# EAGLE design automation_node (EAGLE 9.4.2)
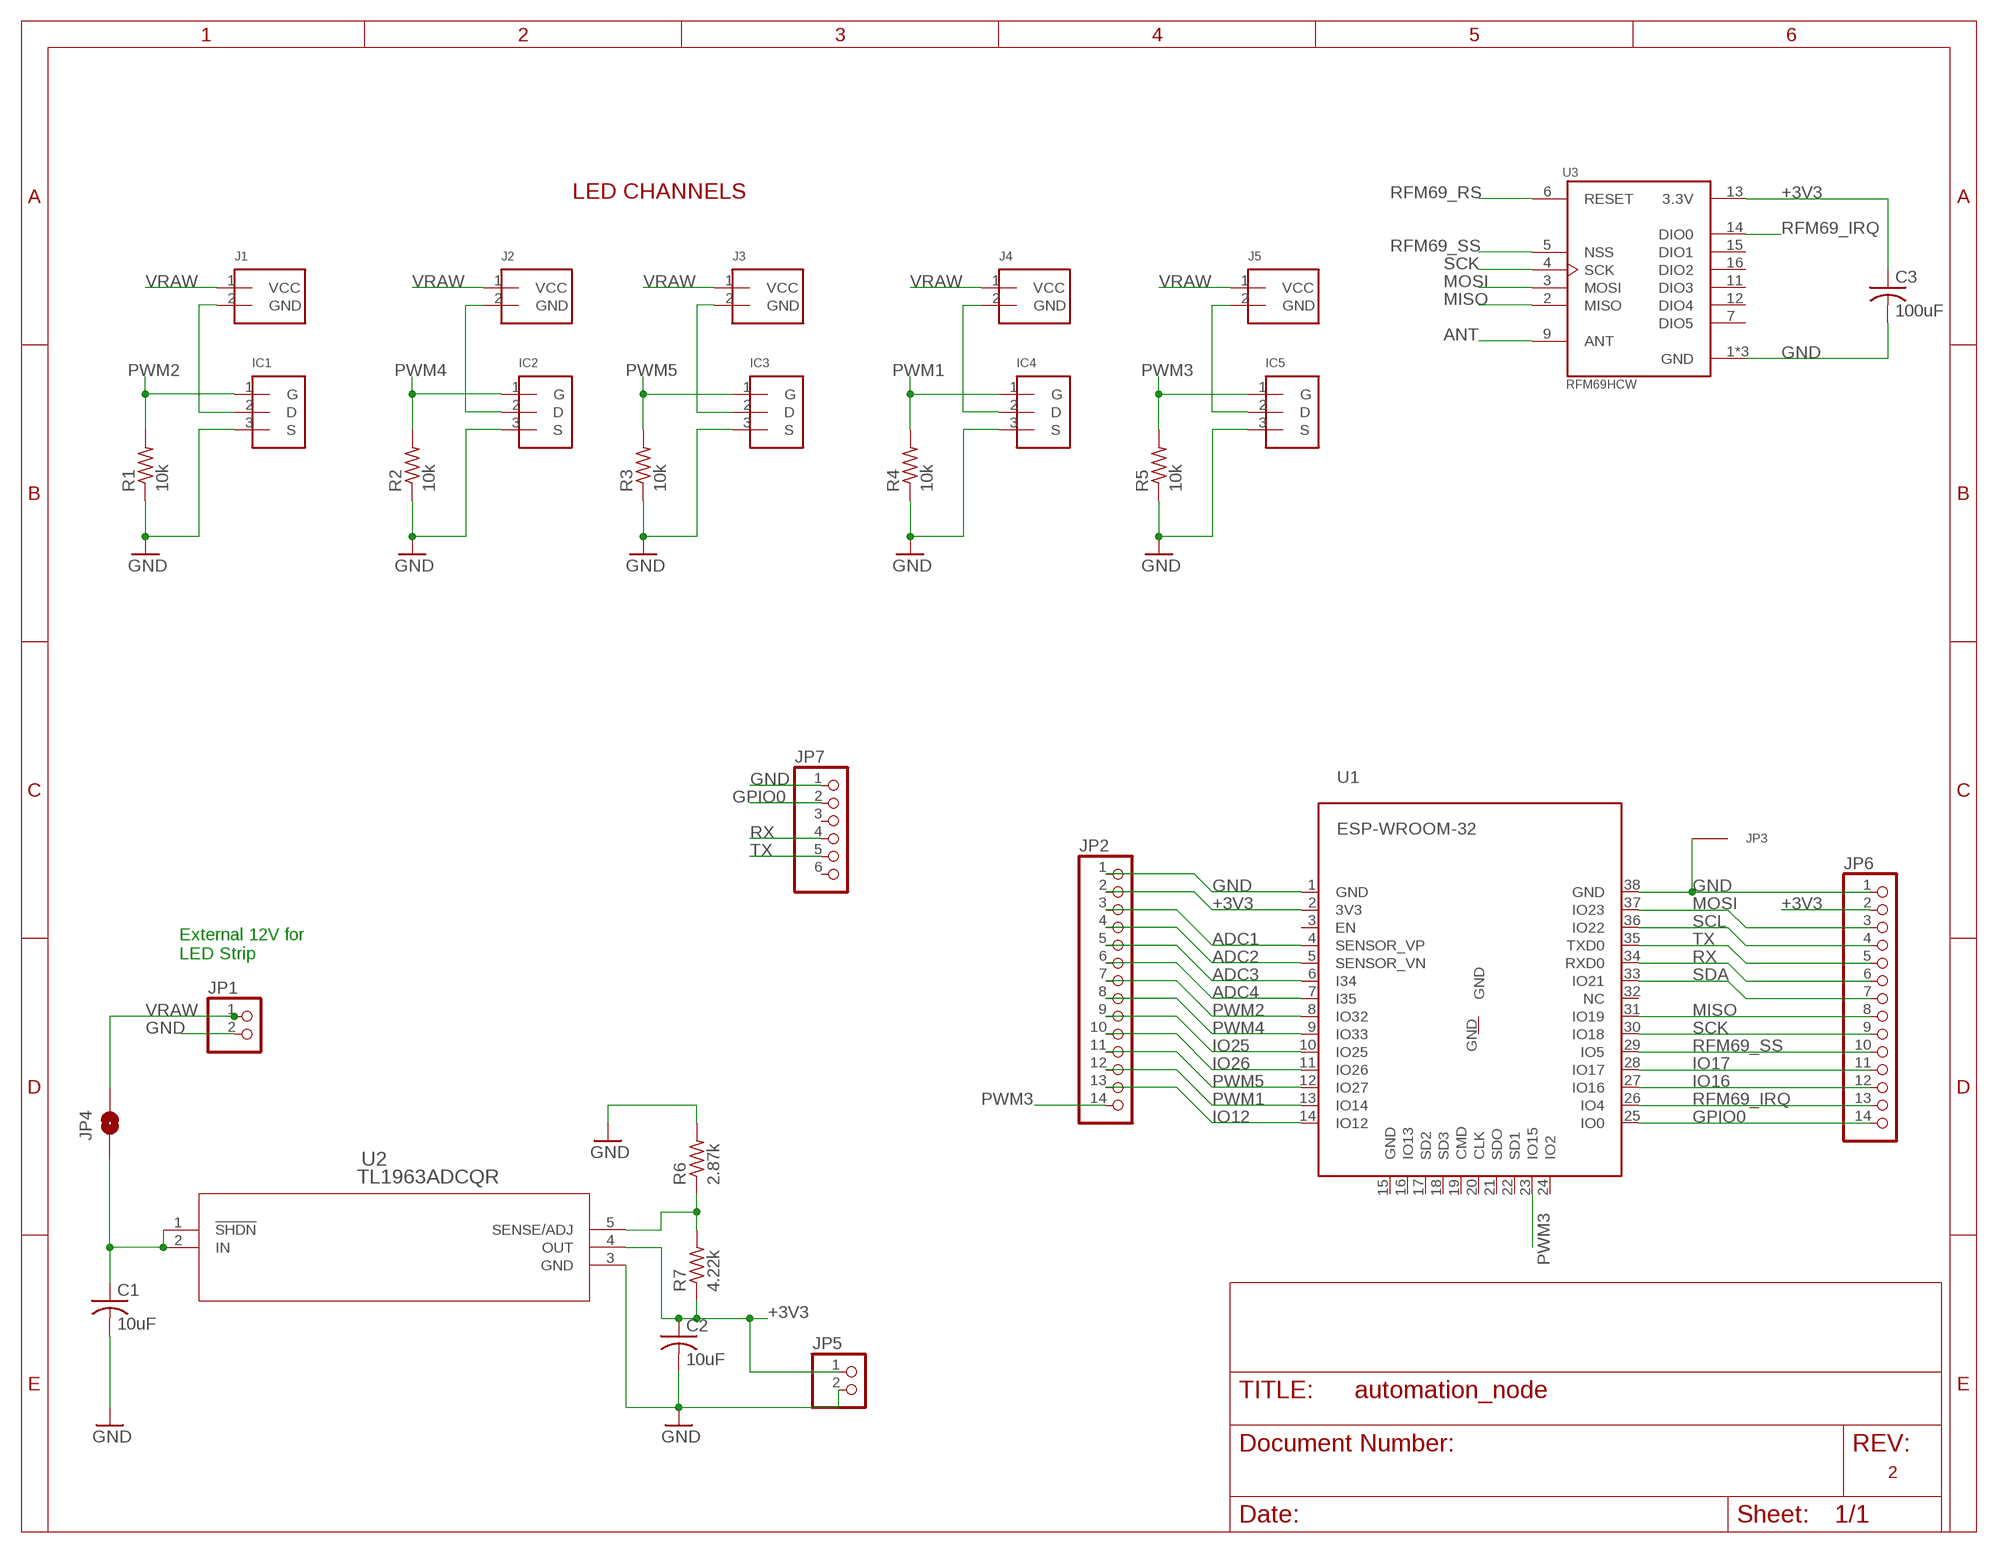
[diagram p0: schematic, sheet 1]

## Parts
C1  10uF  C-USC0805  [C0805]
C2  10uF  C-USC0805  [C0805]
C3  100uF  C-USC0805  [C0805]
IC1  POWER_FET  [POWER_FET]
IC2  POWER_FET  [POWER_FET]
IC3  POWER_FET  [POWER_FET]
IC4  POWER_FET  [POWER_FET]
IC5  POWER_FET  [POWER_FET]
J1  POWER-VIAS  [2CT-VIAS]
J2  POWER-VIAS  [2CT-VIAS]
J3  POWER-VIAS  [2CT-VIAS]
J4  POWER-VIAS  [2CT-VIAS]
J5  POWER-VIAS  [2CT-VIAS]
JP1  PINHD-1X2  [1X02]
JP2  PINHD-1X14  [1X14]
JP3  PROTO_VIA_COMPACT  [PROTO_VIA]
JP4  JUMPER-SMT_2_NO_SILK  [SMT-JUMPER_2_NO_SILK]
JP5  PINHD-1X2  [1X02]
JP6  PINHD-1X14  [1X14]
JP7  PINHD-1X6  [1X06]
R1  10k  R-US_R0805  [R0805]
R2  10k  R-US_R0805  [R0805]
R3  10k  R-US_R0805  [R0805]
R4  10k  R-US_R0805  [R0805]
R5  10k  R-US_R0805  [R0805]
R6  2.87k  R-US_R0805  [R0805]
R7  4.22k  R-US_R0805  [R0805]
U1  ESP-WROOM-32  [ESP-WROOM-32]
U2  TL1963ADCQR  [DCQ6]
U3  RFM69HCW  [MOD_COM-13909]

## Nets
+3V3: C2.1 C3.1 JP2.2 JP5.1 JP6.2 R7.1 U1.2(3V3) U2.4(OUT) U3.13(3.3V)
ADC1: JP2.3 U1.4(SENSOR_VP)
ADC2: JP2.4 U1.5(SENSOR_VN)
ADC3: JP2.5 U1.6(I34)
ADC4: JP2.6 U1.7(I35)
ANT: U3.9(ANT)
GND: C1.2 C2.2 C3.2 IC1.3(S) IC2.3(S) IC3.3(S) IC4.3(S) IC5.3(S) JP1.2 JP2.1 JP3.1 JP5.2 JP6.1 JP7.1 R1.1 R2.1 R3.1 R4.1 R5.1 R6.2 U1.1(GND) U1.38(GND) U2.3(GND) U3.1(GND) U3.8(GND) U3.10(GND)
GPIO0: JP6.14 JP7.2 U1.25(IO0)
IO12: JP2.13 U1.14(IO12)
IO16: JP6.12 U1.27(IO16)
IO17: JP6.11 U1.28(IO17)
IO25: JP2.9 U1.10(IO25)
IO26: JP2.10 U1.11(IO26)
MISO: JP6.8 U1.31(IO19) U3.2(MISO)
MOSI: JP6.3 U1.37(IO23) U3.3(MOSI)
N$1: IC1.2(D) J1.2(GND)
N$2: IC2.2(D) J2.2(GND)
N$4: IC3.2(D) J3.2(GND)
N$5: IC4.2(D) J4.2(GND)
N$6: IC5.2(D) J5.2(GND)
PWM1: IC4.1(G) JP2.12 R4.2 U1.13(IO14)
PWM2: IC1.1(G) JP2.7 R1.2 U1.8(IO32)
PWM3: IC5.1(G) JP2.14 R5.2 U1.23(IO15)
PWM4: IC2.1(G) JP2.8 R2.2 U1.9(IO33)
PWM5: IC3.1(G) JP2.11 R3.2 U1.12(IO27)
RFM69_IRQ: JP6.13 U1.26(IO4) U3.14(DIO0)
RFM69_RS: U3.6(RESET)
RFM69_SS: JP6.10 U1.29(IO5) U3.5(NSS)
RX: JP6.6 JP7.4 U1.34(RXD0)
SCK: JP6.9 U1.30(IO18) U3.4(SCK)
SCL: JP6.4 U1.36(IO22)
SDA: JP6.7 U1.33(IO21)
SHDN: C1.1 JP4.1 U2.1(!SHDN) U2.2(IN)
TX: JP6.5 JP7.5 U1.35(TXD0)
U2_ADJ: R6.1 R7.2 U2.5(SENSE/ADJ)
VRAW: J1.1(VCC) J2.1(VCC) J3.1(VCC) J4.1(VCC) J5.1(VCC) JP1.1 JP4.2
Unconnected: JP7.3 JP7.6 U1.3(EN) U1.15(GND) U1.16(IO13) U1.17(SD2) U1.18(SD3) U1.19(CMD) U1.20(CLK) U1.21(SDO) U1.22(SD1) U1.24(IO2) U1.32(NC) U1.GND U3.7(DIO5) U3.11(DIO3) U3.12(DIO4) U3.15(DIO1) U3.16(DIO2)

## Notes on the sheet
- LED CHANNELS
- External 12V for
  LED Strip
- 2

## Library data of the parts
C1-C3 = rcl:C-US: CAPACITOR, American symbol; SPICEPREFIX: C
IC1-IC5 = VanEagleLib:POWER_FET: Generic footprint for power FET, such as the IRLB8721, IRFZ544, IRF540, etc. Small footprint, meant for vertical installation of through-hole TO-220 FET, minimizing board space.
J1-J5 = VanEagleLib:POWER-VIAS: Generic through-hole vias, meant for connection to external power jack or high-current device.
JP1 JP5 = pinhead:PINHD-1X2: PIN HEADER
JP2 JP6 = pinhead:PINHD-1X14: PIN HEADER
JP3 = VanEagleLib:PROTO_VIA_COMPACT
JP4 = VanEagleLib:JUMPER-SMT_2_NO: Normally open jumper This jumper has two pads in close proximity to each other. Apply solder to close the connection. Round pads are easier to solder for beginners, but are a lot larger. SparkFun Product that uses the round pads: SparkFun EL Sequencer <https://www.sparkfun.com/products/12781>
JP7 = pinhead:PINHD-1X6: PIN HEADER
R1-R7 = rcl:R-US_: RESISTOR, American symbol; SPICEPREFIX: R
U1 = VanEagleLib:ESP-WROOM-32
U2 = VanEagleLib:TL1963ADCQR; MANUFACTURER_PART_NUMBER: TL1963ADCQR; VENDOR: Texas Instruments
U3 = VanEagleLib:RFM69HCW: Rfm69hcw Wireless Transceiver 91; AVAILABILITY: Unavailable; DESCRIPTION: Rfm69hcw Wireless Transceiver 91; MF: SparkFun Electronics; MP: COM-13909; PACKAGE: Module SparkFun Electronics; PRICE: None

## Board
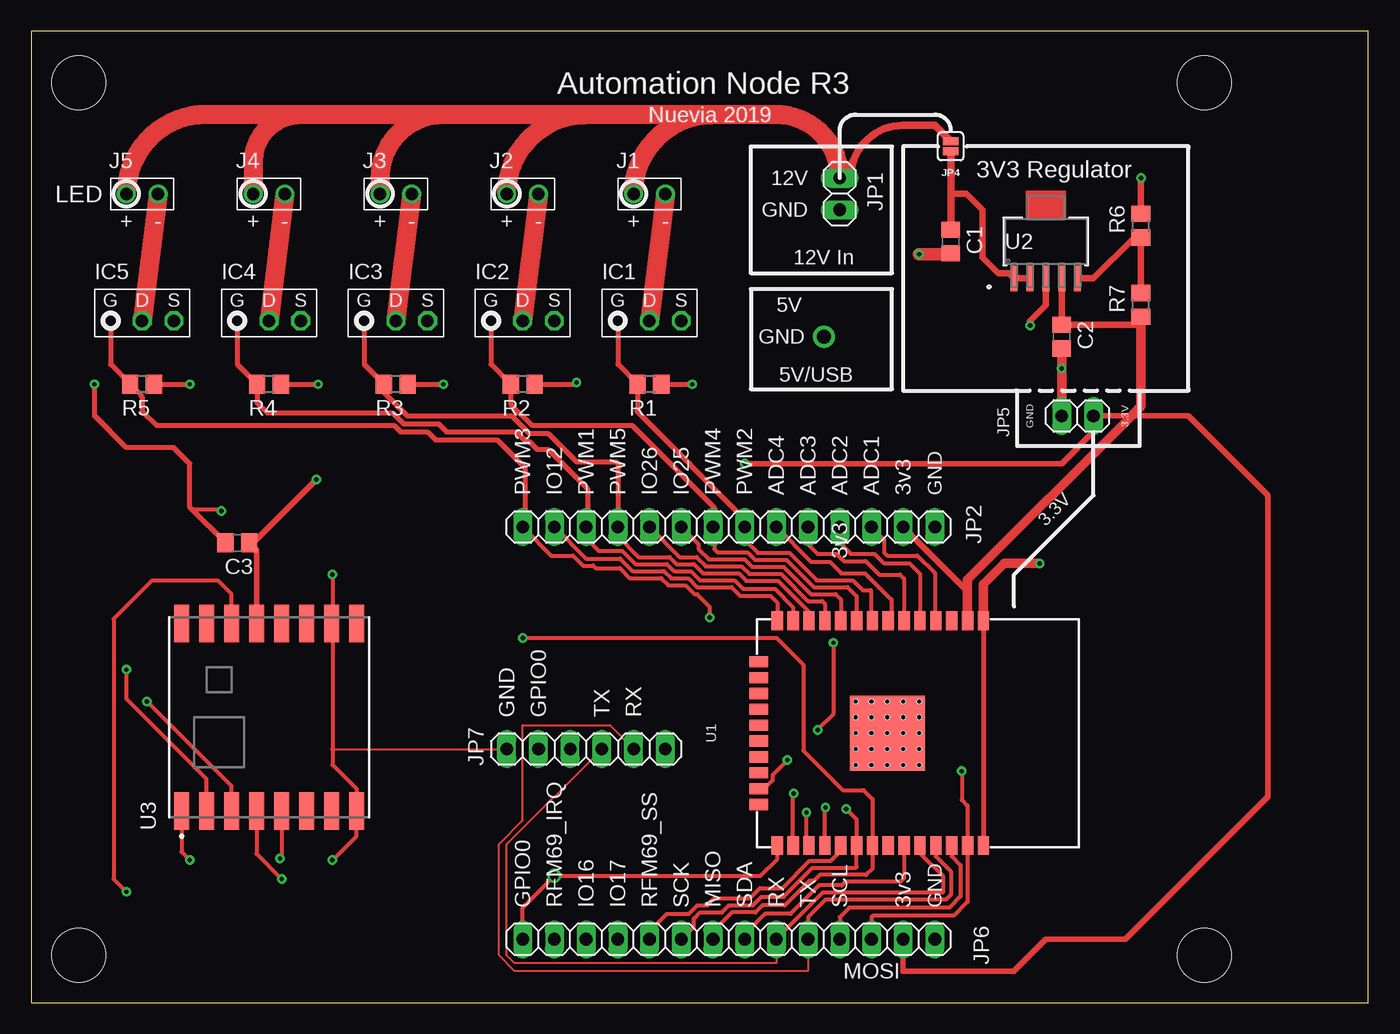
[diagram p1: board, top side]
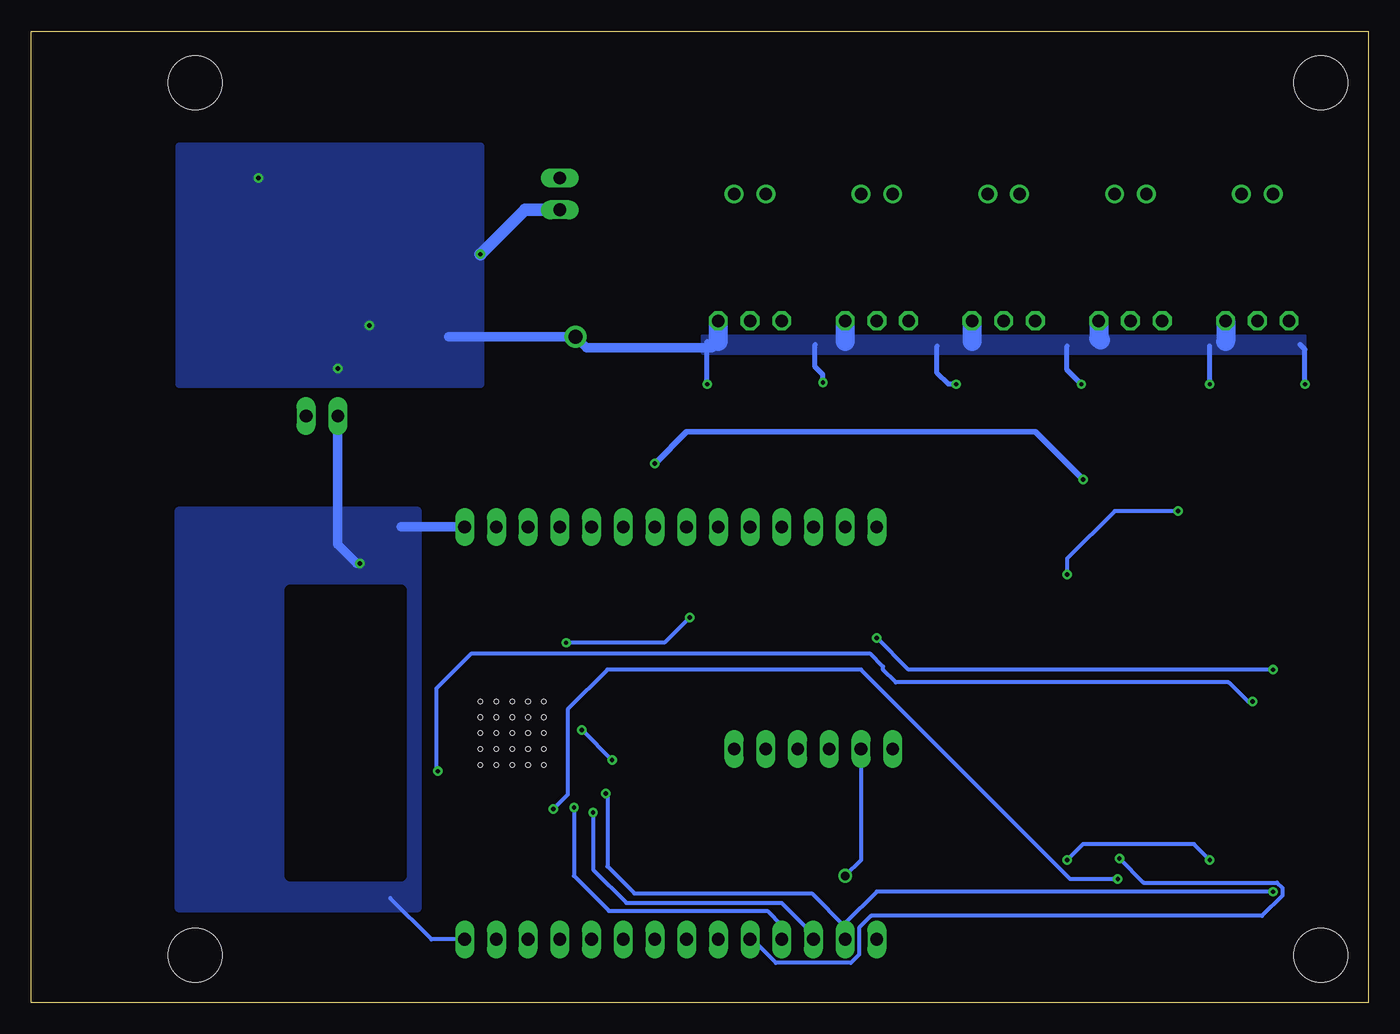
[diagram p2: board, bottom side, seen from below]

Size 107.11 x 77.8 mm. Coordinates in mm from the lower left corner, seen from the top.
Outline: 0,0 107.11,0 107.11,77.8 0,77.8 0,0
Copper layers (1*16): Top 0.035mm / dielectric 1.5mm / Bottom 0.035mm
Design rules "default *": minimum track width 6mil, minimum drill 0.35mm, track to track 10mil, track to pad 8mil, pad to pad 8mil, via to via 8mil, smd to smd 8mil, copper to edge 40mil, drill to drill 6mil, minimum pad ring 10mil, minimum via ring 8mil, stop-mask expansion 4mil, vias tented up to drill 0mil, thermal gap 10mil
Holes 4.3 mm at 3.81,3.81 93.98,3.81 3.81,73.66 93.98,73.66

### Footprints (pad centres in the part's own frame; a part is rotated, then mirrored left to right if it is on the bottom)
C0805 = smd 1.3 x 1.5: 1 -0.95,0; 2 0.95,0
POWER_FET = drill 1 octagon: 1 -2.54,0; 2 0,0; 3 2.54,0
2CT-VIAS = drill 1: 1 -1.27,1.27; 2 1.27,1.27
1X02 = drill 1.016 long: 1 -1.27,0; 2 1.27,0
1X14 = drill 1.016 long: 1 -16.51,0; 2 -13.97,0; 3 -11.43,0; 4 -8.89,0; 5 -6.35,0; 6 -3.81,0; 7 -1.27,0; 8 1.27,0; 9 3.81,0; 10 6.35,0; 11 8.89,0; 12 11.43,0; 13 13.97,0; 14 16.51,0
PROTO_VIA = drill 1.143 pad 1.778: 1 0,0
SMT-JUMPER_2_NO_SILK = smd 0.635 x 1.27: 1 -0.406,0; 2 0.406,0
1X06 = drill 1.016 long: 1 -6.35,0; 2 -3.81,0; 3 -1.27,0; 4 1.27,0; 5 3.81,0; 6 6.35,0
R0805 = smd 1.3 x 1.5: 1 -0.95,0; 2 0.95,0
ESP-WROOM-32 = smd 0.9 x 1.5: 1 7.7,9; 2 6.43,9; 3 5.16,9; 4 3.89,9; 5 2.62,9; 6 1.35,9; 7 0.08,9; 8 -1.19,9; 9 -2.46,9; 10 -3.73,9; 11 -5,9; 12 -6.27,9; 13 -7.54,9; 14 -8.81,9; 25 -8.81,-9; 26 -7.54,-9; 27 -6.27,-9; 28 -5,-9; 29 -3.73,-9; 30 -2.46,-9; 31 -1.19,-9; 32 0.08,-9; 33 1.35,-9; 34 2.62,-9; 35 3.89,-9; 36 5.16,-9; 37 6.43,-9; 38 7.7,-9 | smd 1.5 x 0.9: 15 -10.3,5.715; 16 -10.3,4.445; 17 -10.3,3.175; 18 -10.3,1.905; 19 -10.3,0.635; 20 -10.3,-0.635; 21 -10.3,-1.905; 22 -10.3,-3.175; 23 -10.3,-4.445; 24 -10.3,-5.715 | smd 6 x 6: GND 0,0 | hole 0.35: -2.54,2.54; -1.27,2.54; 0,2.54; 1.27,2.54; 2.54,1.27; 1.27,1.27; 0,1.27; -1.27,1.27; -2.54,1.27; -2.54,0; -1.27,0; 0,0; 1.27,0; 2.54,0; 2.54,-1.27; 1.27,-1.27; 0,-1.27; -1.27,-1.27; -2.54,-1.27; -2.54,-2.54; -1.27,-2.54; 0,-2.54; 1.27,-2.54; 2.54,-2.54; 2.54,2.54
DCQ6 = smd 0.559 x 2.057: 1 -2.54,-2.959; 2 -1.27,-2.959; 3 0,-2.959; 4 1.27,-2.959; 5 2.54,-2.959
MOD_COM-13909 = smd 3 x 1.2: 1 -7.5,7; 2 -7.5,5; 3 -7.5,3; 4 -7.5,1; 5 -7.5,-1; 6 -7.5,-3; 7 -7.5,-5; 8 -7.5,-7; 9 7.5,-7; 10 7.5,-5; 11 7.5,-3; 12 7.5,-1; 13 7.5,1; 14 7.5,3; 15 7.5,5; 16 7.5,7

### Placement (x,y rotation side)
C1  73.66,60.96 270 top
C2  82.55,53.34 270 top
C3  16.51,36.83 180 top
IC1  49.53,54.61 0 top
IC2  39.37,54.61 0 top
IC3  29.21,54.61 0 top
IC4  19.05,54.61 0 top
IC5  8.89,54.61 0 top
J1  49.53,63.5 0 top
J2  39.37,63.5 0 top
J3  29.21,63.5 0 top
J4  19.05,63.5 0 top
J5  8.89,63.5 0 top
JP1  64.77,64.77 270 top
JP2  55.88,38.1 180 top
JP3  63.5,53.34 0 top
JP4  73.66,68.58 90 top
JP5  83.82,46.99 180 top
JP6  55.88,5.08 180 top
JP7  44.45,20.32 0 top
R1  49.53,49.53 180 top
R2  39.37,49.53 180 top
R3  29.21,49.53 180 top
R4  19.05,49.53 180 top
R5  8.89,49.53 180 top
R6  88.9,62.23 90 top
R7  88.9,55.88 90 top
U1  68.58,21.59 0 top
U2  81.28,60.96 0 top
U3  19.05,22.86 90 top

### Tracks (layer width: path | path; a pad name or v marks a point on that pad's centre or on a via)
+3V3  (via drill 0.35)
  Top 0.152: 88.27,46.99 88.2,47.05
  Top 0.457: U3.13 18.05,36.24 C3.1 17.78,36.83 v22.86,41.91 | v57.15,43.18 82.55,43.18 85.09,45.72 JP5.1 88.27,46.99 92.71,46.99 99.06,40.64 99.06,16.51 87.63,5.08 81.28,5.08 78.74,2.54 69.85,2.54 JP6.2
  Top 0.508: U2.4 C2.1 88.71,54.29 R7.1 | JP2.2 75.01,32.94
  Top 0.762: R7.1 88.9,47.75 88.2,47.05 75.01,33.86 U1.2 75.01,32.94
  Bottom 0.457: v57.15,43.18 54.61,45.72 26.67,45.72 v22.86,41.91
ADC1
  Top 0.305: JP2.3 68.33,37.08 68.33,36.07 68.58,35.81 70.99,35.81 72.39,34.42 72.39,30.67 U1.4
ADC2
  Top 0.305: JP2.4 64.77,36.83 65.66,35.94 67.56,35.94 68.33,35.18 70.36,35.18 71.2,34.34 U1.5
ADC3
  Top 0.305: JP2.5 62.23,36.7 62.99,35.94 64.5,35.94 65.09,35.36 66.87,35.36 67.93,34.29 69.6,34.29 69.93,33.96 U1.6
ADC4
  Top 0.305: JP2.6 62.48,35.31 63.98,35.31 64.9,34.39 66.8,34.39 68.91,32.28 68.91,30.84 U1.7
GND  (via drill 0.35)
  Top 0.152: C1.2 73.59,59.94 | 24.13,20.32 JP7.1
  Top 0.305: 12.86,39.53 15.08,39.53 v15.24,39.37 | v24.13,34.29 24.13,30.44 U3.10 24.13,30.28 24.13,20.32 24.13,19.05 26.05,17.13 U3.8 26.05,13.35 v24.13,11.43 | U3.1 12.05,12.08 v12.7,11.43
  Top 0.381: U1.1 U1.38 | R5.1 v12.7,49.53 | R4.1 v22.99,49.53 | R3.1 v33.02,49.53 | R2.1 43.56,49.53 v43.69,49.66 | R1.1 v52.96,49.53 | C3.2 12.86,39.53 12.7,39.69 12.7,43.18 11.43,44.45 7.62,44.45 5.08,46.99 v5.08,49.53
  Top 0.508: R6.2 v88.9,66.04 | U2.3 81.28,55.84 80.01,54.57 v80.01,54.23
  Top 0.762: v80.77,35.18 77.95,35.18 76.28,33.51 U1.1 | C2.2 v82.55,50.8 JP5.2
  Top 1.016: 73.59,59.94 v71.12,59.94
  Bottom 0.305: 78.36,8.38 75.06,5.08 JP6.1 | v15.24,39.37 20.32,39.37 24.13,35.56 v24.13,34.29 | v12.7,11.43 13.97,12.7 22.86,12.7 v24.13,11.43
  Bottom 0.381: v12.7,49.53 12.7,52.58 | v22.99,49.53 24.13,50.67 24.13,52.58 | v33.02,49.53 33.66,49.53 34.54,50.42 34.54,52.58 | v43.69,49.66 43.69,50.29 44.32,50.93 44.32,52.7 | v52.96,49.53 52.96,52.96 | v5.08,49.53 5.08,52.32 5.46,52.7
  Bottom 0.762: 73.66,53.34 JP3.1 62.61,52.45 52.58,52.45 52.07,52.96 | JP5.2 82.55,36.7 81.03,35.18 v80.77,35.18 | JP2.1 77.47,38.1
  Bottom 1.016: JP1.2 67.56,63.5 v71.12,59.94
  Bottom 1.524: IC5.3 11.43,52.96 | IC4.3 21.59,53.21 21.46,53.09 | IC3.3 31.75,52.96 | IC2.3 41.91,52.96 | 52.07,52.96 IC1.3
  pour Bottom (isolate 0.406): 95.25,68.58 71.12,68.58 71.12,49.53 95.25,49.53
  pour Bottom (isolate 0.406): 76.2,39.37 76.2,7.62 95.25,7.62 95.25,39.37 92.71,39.37
  pour Bottom: 5.08,53.34 53.34,53.34 53.34,52.07 5.08,52.07
GPIO0  (via drill 0.7)
  Top 0.305: JP6.14 39.37,7.62 v41.91,10.16 58.42,10.16 59.77,11.51 U1.25
  Bottom 0.305: v41.91,10.16 40.64,11.43 JP7.2
IO12
  Top 0.305: JP2.13 44.45,35.56 47.19,35.56 48.18,34.57 50.69,34.57 51.27,33.98 52.64,33.98 53.35,33.27 56.11,33.27 56.79,32.59 59.23,32.59 59.77,32.05 U1.14
IO16  (via drill 0.35)
  Top 0.305: U1.27 62.1,12.8 v62.1,15.24
  Bottom 0.305: v62.1,15.24 62.1,10.67 59.44,8 46.99,8 44.45,5.46 JP6.12
IO17  (via drill 0.35)
  Top 0.305: U1.28 63.58,15.57 v63.63,15.62
  Bottom 0.305: v63.63,15.62 63.63,10.16 60.83,7.37 48.13,7.37 46.99,6.22 JP6.11
IO25
  Top 0.305: JP2.9 53.47,36.7 53.47,36.32 54.28,35.51 57.14,35.51 57.75,34.9 60.28,34.9 62.47,32.72 64.44,32.72 64.85,32.3 U1.10
IO26
  Top 0.305: JP2.10 51.94,35.69 53.31,35.69 54.05,34.95 56.91,34.95 57.52,34.34 60.05,34.34 62.23,32.16 63.37,32.16 63.58,31.95 U1.11
MISO  (via drill 0.35)
  Top 0.305: JP6.8 54.61,5.71 56.13,7.24 58.04,7.24 58.6,7.8 60.38,7.8 62.36,9.78 62.71,9.78 63.17,10.24 66.88,10.24 67.39,10.75 U1.31 67.39,16.3 66.67,17.02 65.02,17.02 61.85,20.19 61.85,27.05 59.69,29.21 v39.37,29.21 | U3.2 14.05,17.9 7.62,24.33 v7.62,26.67
  Bottom 0.305: v7.62,26.67 36.83,26.67 v39.37,29.21
MOSI  (via drill 0.35)
  Top 0.305: JP6.3 67.31,6.86 67.44,6.99 73.91,6.99 75.01,8.08 U1.37 75.01,15.79 74.55,16.26 v74.55,18.54 | U3.3 16.05,17.35 v9.27,24.13
  Bottom 0.305: v9.27,24.13 9.65,24.13 11.18,25.65 37.85,25.65 38.86,26.67 38.86,26.92 39.88,27.94 71.88,27.94 74.68,25.15 74.68,18.67 v74.55,18.54
N$1
  Top 1.524: J1.2 IC1.2
N$2
  Top 1.524: J2.2 IC2.2
N$4
  Top 1.524: J3.2 IC3.2
N$5
  Top 1.524: J4.2 IC4.2
N$6
  Top 1.524: J5.2 IC5.2
PWM1
  Top 0.305: JP2.12 44.45,37.72 44.45,37.21 45.47,36.2 47.34,36.2 48.41,35.13 50.92,35.13 51.48,34.57 51.54,34.57 51.56,34.54 52.87,34.54 53.59,33.83 56.34,33.83 57.02,33.15 59.56,33.15 61.04,31.67 U1.13
  Top 0.381: IC4.1 16.51,51.12 R4.2 18.1,48.07 18.92,47.24 28.95,47.24 29.84,46.35 32.64,46.35 33.27,45.72 38.84,45.72 39.61,44.96 39.88,44.96 40.51,44.32 41.4,44.32 44.58,41.15 44.58,37.85 44.45,37.72
PWM2
  Top 0.305: JP2.7 57.15,37.97 57.15,37.08 58.22,36.02 60.74,36.02 62.93,33.83 65.83,33.83 66.61,33.05 67.26,33.05 67.26,30.72 U1.8
  Top 0.381: IC1.1 46.99,51.12 R1.2 48.58,47.44 48.51,47.37 57.15,38.73 57.15,37.97
PWM3  (via drill 0.35)
  Top 0.305: JP2.14 39.56,37.91 41.66,35.81 43.41,35.81 44.22,35 45.01,35 45.21,34.8 47.16,34.8 47.95,34.01 50.46,34.01 51.04,33.43 52.41,33.43 53.12,32.72 53.34,32.72 54.36,31.7 v54.36,30.86 | v64.26,28.83 64.26,23.11 v62.99,21.84 | v60.58,19.43 59.39,18.24 59.39,17.82 58.71,17.14 U1.23
  Top 0.381: IC5.1 6.35,51.12 R5.2 8.8,48.67 8.8,48.62 8.89,48.52 8.89,47.37 10.03,46.23 29.07,46.23 29.57,45.72 31.75,45.72 32.38,45.09 37.34,45.09 39.56,42.86 39.56,37.91
  Bottom 0.305: v54.36,30.86 56.39,28.83 v64.26,28.83 | v62.99,21.84 v60.58,19.43
PWM4
  Top 0.305: JP2.8 54.74,37.97 54.74,36.32 54.99,36.07 57.38,36.07 57.98,35.46 60.51,35.46 62.7,33.27 65.41,33.27 66.12,32.56 U1.9
  Top 0.381: IC2.1 36.83,51.12 R2.2 38.42,47.94 40.13,46.23 48.13,46.23 54.74,39.62 54.74,37.97
PWM5
  Top 0.305: JP2.11 46.99,37.97 46.99,37.34 48.64,35.69 51.15,35.69 51.71,35.13 53.08,35.13 53.82,34.39 56.68,34.39 57.29,33.78 59.82,33.78 62.31,31.29 U1.12
  Top 0.381: IC3.1 26.67,51.12 R3.2 28.26,48.83 30.1,46.99 38.47,46.99 39.87,45.59 41.4,45.59 43.69,43.31 46.86,43.31 46.99,43.18 46.99,37.97
RFM69_IRQ  (via drill 0.35)
  Top 0.305: U1.26 61.04,16.72 v61.09,16.76 | U3.14 16.05,32.72 14.99,33.78 9.65,33.78 6.6,30.73 6.6,9.91 v7.62,8.89
  Bottom 0.305: v61.09,16.76 61.09,16.64 60.96,16.51 60.96,10.92 58.8,8.76 44.58,8.76 41.91,6.1 JP6.13 41.91,6.35 39.37,8.89 v7.62,8.89
RFM69_SS  (via drill 0.35)
  Top 0.305: JP6.10 49.53,5.71 50.93,7.11 52.68,7.11 53.36,7.8 54.15,7.8 54.71,8.36 57.58,8.36 58.39,9.17 60.17,9.17 62.35,11.35 64.05,11.35 64.85,12.16 U1.29 | U3.5 20.05,11.67 v19.94,11.56
  Bottom 0.305: JP6.10 49.33,5.08 47.45,3.2 41.45,3.2 40.79,3.85 40.79,6 39.83,6.96 8.51,6.96 6.89,8.59 6.89,9.19 7.32,9.62 18.01,9.62 v19.94,11.56
RX
  Top 0.152: JP7.4 38.1,12.7 38.1,3.81 38.73,3.17 59.69,3.17 JP6.6
  Top 0.305: U1.34 71.2,11.98 73.03,10.16 73.03,8.81 63.4,8.81 59.69,5.11 JP6.6
SCK  (via drill 0.35)
  Top 0.305: JP6.9 53.09,6.1 53.09,6.73 53.59,7.24 55.34,7.24 55.9,7.8 57.81,7.8 58.49,8.48 60.27,8.48 62.58,10.79 66.04,10.79 66.12,10.88 U1.30 66.12,14.68 v65.28,15.52 | v20.07,9.91 18.05,11.92 U3.4
  Bottom 0.305: v20.07,9.91 23.88,9.91 40.64,26.67 60.96,26.67 64.14,23.5 64.14,16.66 v65.28,15.52
SCL
  Top 0.305: U1.36 73.74,11.73 74.45,11.02 74.45,8.51 73.56,7.62 65.53,7.62 64.77,6.86 JP6.4
SDA
  Top 0.305: U1.33 69.93,9.99 69.62,9.68 65.22,9.68 64.94,9.4 63.12,9.4 60.83,7.11 58.8,7.11 57.15,5.46 JP6.7
SHDN
  Top 0.508: U2.2 U2.1 78.32,58.42 77.47,58.42 76.2,59.69 76.2,63.5 74.93,64.77 73.66,64.77
  Top 0.61: C1.1 73.66,64.77 JP4.1
TX
  Top 0.152: JP7.5 46.35,22.23 39.37,22.23 39.37,14.61 37.47,12.7 37.47,3.81 38.73,2.54 62.23,2.54 JP6.5
  Top 0.305: U1.35 72.47,11.73 73.66,10.54 73.66,8.64 73.28,8.26 63.63,8.26 62.23,6.86 JP6.5
U2_ADJ
  Top 0.508: R7.2 R6.1 88.28,61.19 85.09,58 U2.5
VRAW
  Top 0.61: JP1.1 65.63,66.04 arc-90 69.85,70.26 72.39,70.26 JP4.2
  Top 1.016: 44.45,71.12 45.72,71.12
  Top 1.524: JP1.1 arc90 59.69,71.12 54.61,71.12 | J5.1 arc-90 13.97,71.12 21.59,71.12 | 54.61,71.12 45.72,71.12 33.02,71.12 | 33.02,71.12 21.59,71.12 | 21.59,71.12 arc90 17.78,67.31 J4.1 | 33.02,71.12 arc90 27.94,66.04 J3.1 | J2.1 arc-90 44.45,71.12 | J1.1 arc-90 54.61,71.12

### Text on the board
tPlace: Automation Node R3 | Nuevia 2019 | 12V | 3V3 Regulator | LED | GND | + | - | + | - | + | - | + | - | + | - | 12V In | 5V | GND | 5V/USB | GND | 3.3V | 3.3V | GND | GPIO0 | TX | RX
tNames: PWM3 | IO12 | PWM1 | PWM5 | IO26 | IO25 | PWM4 | PWM2 | ADC4 | ADC3 | ADC2 | ADC1 | 3v3 | GND | 3v3 | GPIO0 | RFM69_IRQ | IO16 | IO17 | RFM69_SS | SCK | MISO | SDA | RX | TX | SCL | 3v3 | GND | MOSI